# Altium schematic sheet CO2_Sensor.SchDoc
size A; SheetNumber: 8; SheetTotal: 10
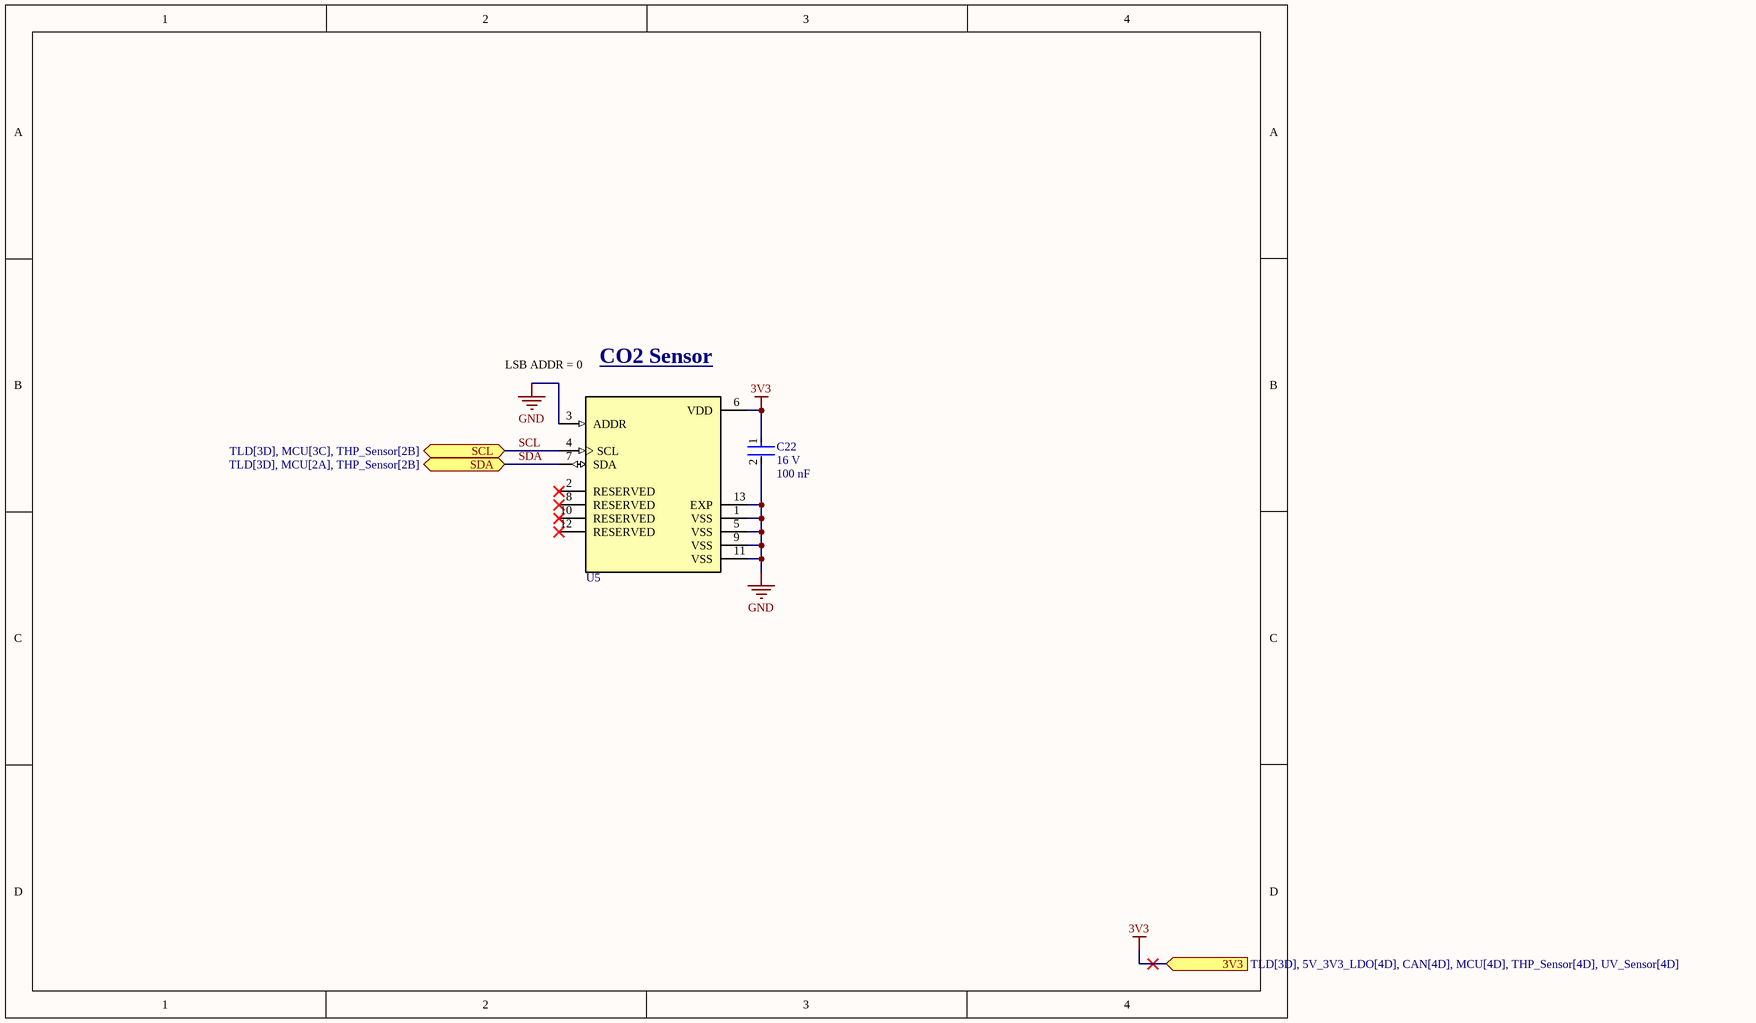
[diagram p0: CO2_Sensor.SchDoc]

## Parts
C22  Voltage Rating: 16 V  Capacitance: 100 nF  [CAP-0402]  (hidden comment: CC0402KRX7R7BB104)
U5  STC31-C-R3  [XDCR_STC31-C-R3]  (value not drawn)

## Ports
3V3 (in, see TLD[3D], 5V_3V3_LDO[4D], CAN[4D], MCU[4D], THP_Sensor[4D], UV_Sensor[4D]), SCL (bidir, see TLD[3D], MCU[3C], THP_Sensor[2B]), SDA (bidir, see TLD[3D], MCU[2A], THP_Sensor[2B])

## Nets
3V3: C22.1 U5.6(VDD) ; port 3V3
GND: C22.2 U5.1(VSS) U5.3(ADDR) U5.5(VSS) U5.9(VSS) U5.11(VSS) U5.13(EXP)
SCL: U5.4(SCL) ; port SCL
SDA: U5.7(SDA) ; port SDA

Not connected (* = marked no-connect by the designer): U5 2(RESERVED)* 8(RESERVED)* 10(RESERVED)* 12(RESERVED)*

## Notes on the sheet
- (near U5) LSB ADDR = 0
- (near U5) CO2 Sensor

## Library data of the parts
C22 = CAP-0.1U-0001: CAP CER 0.1UF 16V X7R 0402; ComponentLink2Description: Datasheet; ComponentLink2URL: https://www.yageo.com/upload/media/product/productsearch/datasheet/mlcc/UPY-GPHC_X7R_6.3V-to-250V_24.pdf; Device Class: Ceramic; Size: 0402
U5 = SENS-CO2: SENSOR CARBON DIOXIDE I2C OUTPUT; MF: Sensirion; SnapEDA_Link: https://www.snapeda.com/parts/STC31-C-R3/Sensirion/view-part/?ref=snap; Package: Package; Value: *; MP: STC31-C-R3; Check_prices: https://www.snapeda.com/parts/STC31-C-R3/Sensirion/view-part/?ref=eda; ComponentLink1Description: Datasheet; ComponentLink1URL: https://sensirion.com/media/documents/D9F76A0F/686E30AC/TC_DS_STC31-C_D1.pdf